# Altium schematic sheet crankSignal.SchDoc
size A4
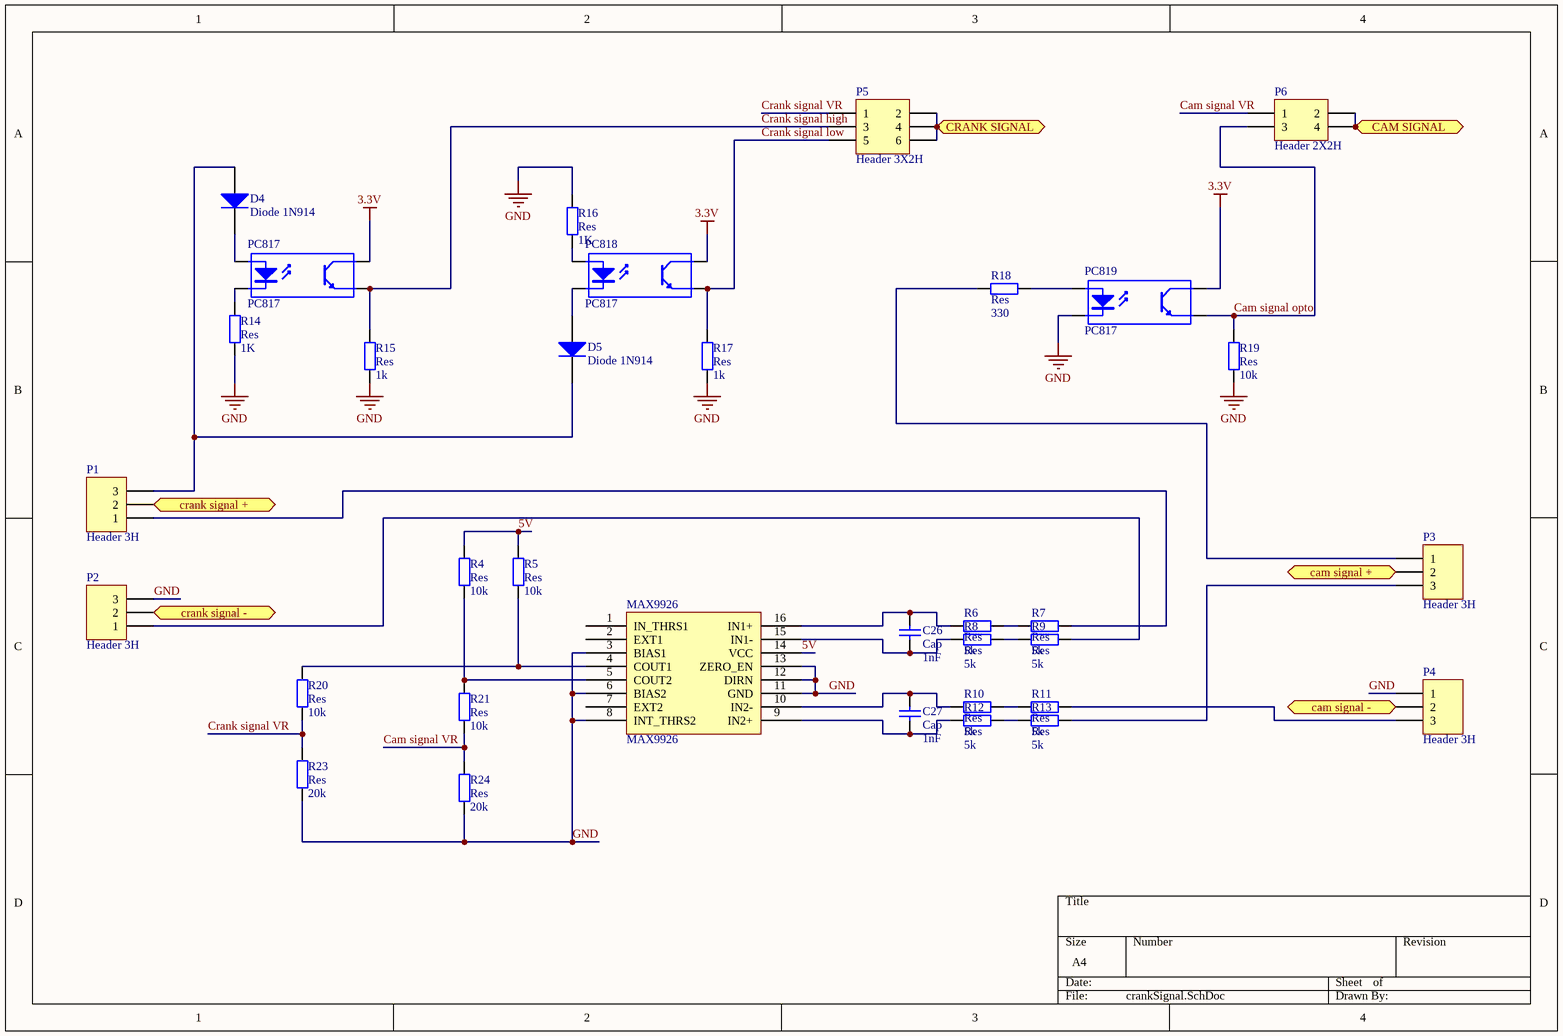
[diagram p0: crankSignal.SchDoc]

## Parts
C26  Cap  value 1nF  [1206 footprint]
C27  Cap  value 1nF  [1206 footprint]
D4  Diode 1N914  [DO-35]
D5  Diode 1N914  [DO-35]
MAX9926  MAX9926  [MAX9927]
P1  Header 3H  [HDR1X3H]
P2  Header 3H  [HDR1X3H]
P3  Header 3H  [HDR1X3H]
P4  Header 3H  [HDR1X3H]
P5  Header 3X2H  [HDR2X3H]
P6  Header 2X2H  [HDR2X2H]
PC817  PC817  [PC817 SOP4]
PC818  PC817  [PC817 SOP4]
PC819  PC817  [PC817 SOP4]
R4  Res  value 10k  [1206 resistor]
R5  Res  value 10k  [1206 resistor]
R6  Res  value 5k  [1206 resistor]
R7  Res  value 5k  [1206 resistor]
R8  Res  value 5k  [1206 resistor]
R9  Res  value 5k  [1206 resistor]
R10  Res  value 5k  [1206 resistor]
R11  Res  value 5k  [1206 resistor]
R12  Res  value 5k  [1206 resistor]
R13  Res  value 5k  [1206 resistor]
R14  Res  value 1K  [1206 resistor]
R15  Res  value 1k  [1206 resistor]
R16  Res  value 1K  [1206 resistor]
R17  Res  value 1k  [1206 resistor]
R18  Res  value 330  [1206 resistor]
R19  Res  value 10k  [1206 resistor]
R20  Res  value 10k  [1206 resistor]
R21  Res  value 10k  [1206 resistor]
R23  Res  value 20k  [1206 resistor]
R24  Res  value 20k  [1206 resistor]

## Ports
CAM SIGNAL (bidir), cam signal + (bidir), cam signal - (bidir), CRANK SIGNAL (bidir), crank signal + (bidir), crank signal - (bidir)

## Nets
3.3V: PC817.4(C) PC818.4(C) PC819.4(C)
GND: MAX9926.3(BIAS1) MAX9926.6(BIAS2) MAX9926.8(INT_THRS2) MAX9926.11(GND) MAX9926.12(DIRN) MAX9926.13(ZERO_EN) P2.3 P4.1 PC819.2(K) R14.1 R15.1 R16.2 R17.1 R19.1 R23.2 R24.2
5V: MAX9926.14(VCC) R4.1 R5.2
CAM SIGNAL: P6.2 P6.4 ; port CAM SIGNAL
cam signal +: P3.2 ; port cam signal +
cam signal -: P4.2 ; port cam signal -
Cam signal opto: P6.3 PC819.3(E) R19.2
Cam signal VR: P6.1 R21.2 R24.1
CRANK SIGNAL: P5.2 P5.4 P5.6 ; port CRANK SIGNAL
crank signal +: P1.2 ; port crank signal +
crank signal -: P2.2 ; port crank signal -
Crank signal high: P5.3 PC817.3(E) R15.2
Crank signal low: P5.5 PC818.3(E) R17.2
Crank signal VR: P5.1 R20.2 R23.1
NetC26_1: C26.1 MAX9926.15(IN1-) R8.1
NetC26_2: C26.2 MAX9926.16(IN1+) R6.2
NetC27_1: C27.1 MAX9926.9(IN2+) R12.1
NetC27_2: C27.2 MAX9926.10(IN2-) R10.2
NetD4_1: D4.1(A) D5.2(K) P1.3
NetD4_2: D4.2(K) PC817.1(A)
NetD5_1: D5.1(A) PC818.2(K)
NetMAX9926_4: MAX9926.4(COUT1) R5.1 R20.1
NetMAX9926_5: MAX9926.5(COUT2) R4.2 R21.1
NetP1_1: P1.1 R7.1
NetP2_1: P2.1 R9.1
NetP3_1: P3.1 R18.2
NetP3_3: P3.3 R13.1
NetP4_3: P4.3 R11.1
NetPC817_2: PC817.2(K) R14.2
NetPC818_1: PC818.1(A) R16.1
NetPC819_1: PC819.1(A) R18.1
NetR6_1: R6.1 R7.2
NetR8_2: R8.2 R9.2
NetR10_1: R10.1 R11.2
NetR12_2: R12.2 R13.2

Not connected (* = marked no-connect by the designer): MAX9926 1(IN_THRS1) 2(EXT1) 7(EXT2)

## Library data of the parts
D4 D5 = Diode 1N914: High Conductance Fast Diode; Published: 8-Jun-2000; LatestRevisionDate: 17-Jul-2002; LatestRevisionNote: Re-released for DXP Platform.; DatasheetVersion: 1997; PackageReference: DO-35; Publisher: Altium Limited; PackageDescription: Diode, Axial; Body 3.8 x 1.9 mm (LxDia. max), Lead Dia. 0.53 mm (max); Code_JEDEC: DO-204-AH; ComponentLink1Description: Manufacturer Link; ComponentLink1URL: http://www.fairchildsemi.com/; ComponentLink2Description: Datasheet; ComponentLink2URL: http://www.fairchildsemi.com/ds/1N%2F1N4448.pdf
P1-P4 = Header 3H: Header, 3-Pin, Right Angle; LatestRevisionDate: 17-Jul-2002; LatestRevisionNote: Re-released for DXP Platform.; Publisher: Altium Limited
P5 = Header 3X2H: Header, 3-Pin, Dual row, Right Angle; LatestRevisionDate: 17-Jul-2002; LatestRevisionNote: Re-released for DXP Platform.; Publisher: Altium Limited
P6 = Header 2X2H: Header, 2-Pin, Dual row, Right Angle; LatestRevisionDate: 17-Jul-2002; LatestRevisionNote: Re-released for DXP Platform.; Publisher: Altium Limited